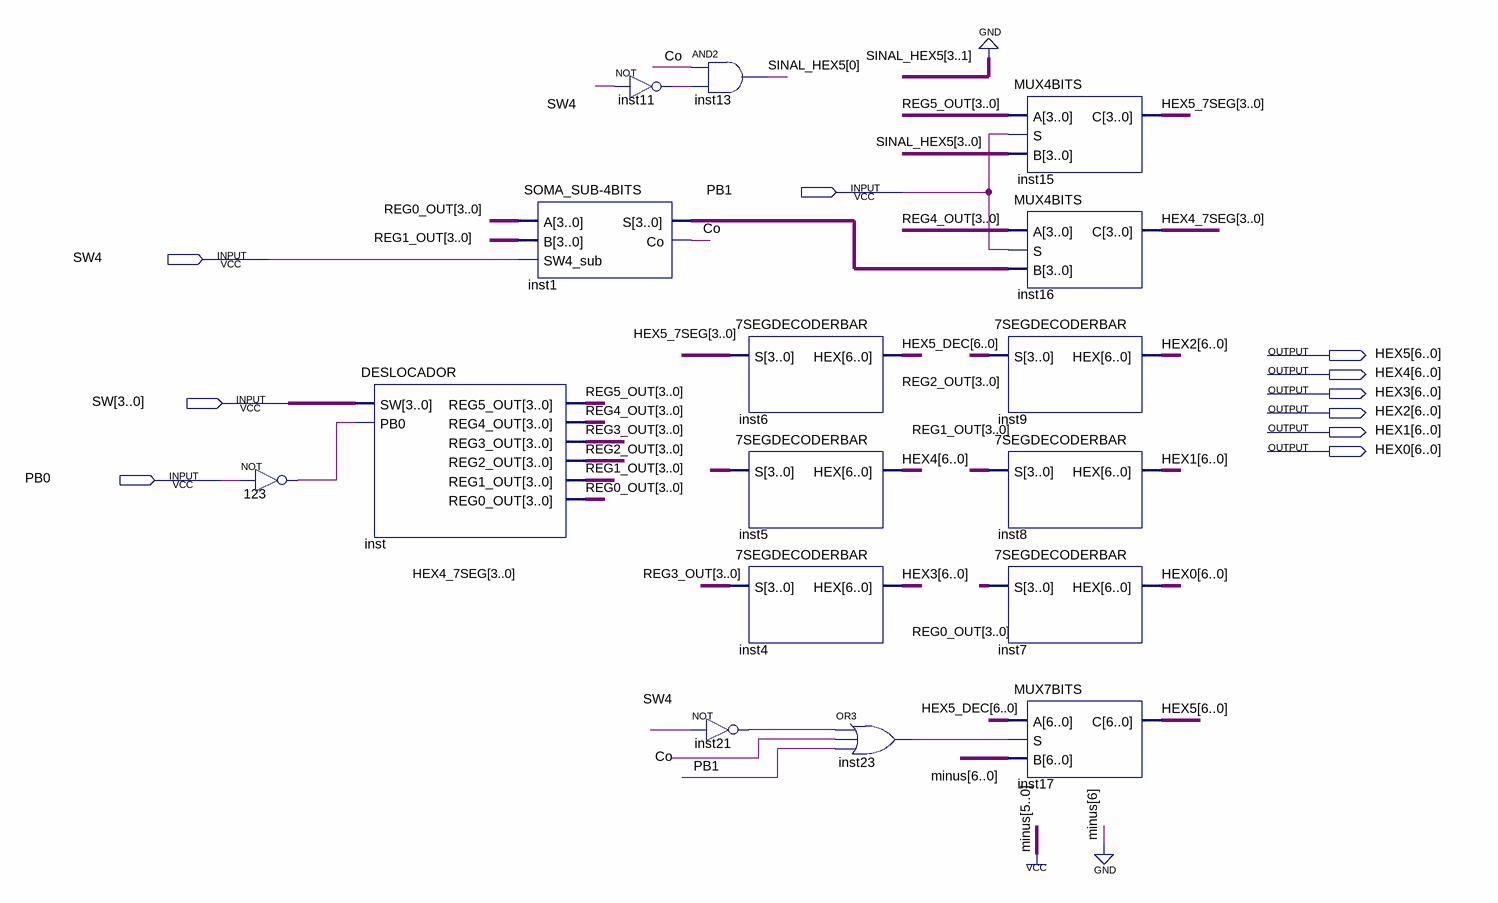
[diagram p0: schematic sheet]
// Quartus schematic LAB02.bdf as structural Verilog: 16 symbols, 10 pins
module LAB02 (
  input  PB1,
  input  SW4,
  input  [3:0] SW,
  input  PB0,
  output [6:0] HEX5,
  output [6:0] HEX4,
  output [6:0] HEX3,
  output [6:0] HEX2,
  output [6:0] HEX1,
  output [6:0] HEX0
);

  wire Co, inst11_out, inst21_out, inst23_out, n123_out;
  wire [0:0] SINAL_HEX5;
  wire [3:0] HEX4_7SEG, HEX5_7SEG, inst1_s, REG0_OUT, REG1_OUT, REG2_OUT, REG3_OUT, REG4_OUT, REG5_OUT;
  wire [6:0] HEX5_DEC;

  not u_123 (n123_out, PB0);
  DESLOCADOR inst (
    .SW(SW), .PB0(n123_out), .REG5_OUT(REG5_OUT), .REG4_OUT(REG4_OUT), .REG3_OUT(REG3_OUT),
    .REG2_OUT(REG2_OUT), .REG1_OUT(REG1_OUT), .REG0_OUT(REG0_OUT));
  \SOMA_SUB-4BITS  inst1 (.A(REG0_OUT), .B(REG1_OUT), .SW4_sub(SW4), .S(inst1_s), .Co(Co));
  not inst11 (inst11_out, SW4);
  and inst13 (SINAL_HEX5[0], Co, inst11_out);
  not inst21 (inst21_out, SW4);
  \7SEGDECODERBAR  inst6 (.S(HEX5_7SEG), .HEX(HEX5_DEC));
  \7SEGDECODERBAR  inst5 (.S(HEX4_7SEG), .HEX(HEX4));
  \7SEGDECODERBAR  inst4 (.S(REG3_OUT), .HEX(HEX3));
  or inst23 (inst23_out, inst21_out, Co, PB1);
  MUX4BITS inst15 (.A(REG5_OUT), .S(PB1), .B({3'b000, SINAL_HEX5[0]}), .C(HEX5_7SEG));
  MUX4BITS inst16 (.A(REG4_OUT), .S(PB1), .B(inst1_s), .C(HEX4_7SEG));
  \7SEGDECODERBAR  inst9 (.S(REG2_OUT), .HEX(HEX2));
  \7SEGDECODERBAR  inst8 (.S(REG1_OUT), .HEX(HEX1));
  \7SEGDECODERBAR  inst7 (.S(REG0_OUT), .HEX(HEX0));
  MUX7BITS inst17 (.A(HEX5_DEC), .S(inst23_out), .B(7'b0111111), .C(HEX5));
endmodule
